# Altium project BMS Bottom Cell & Controller.PrjPcb
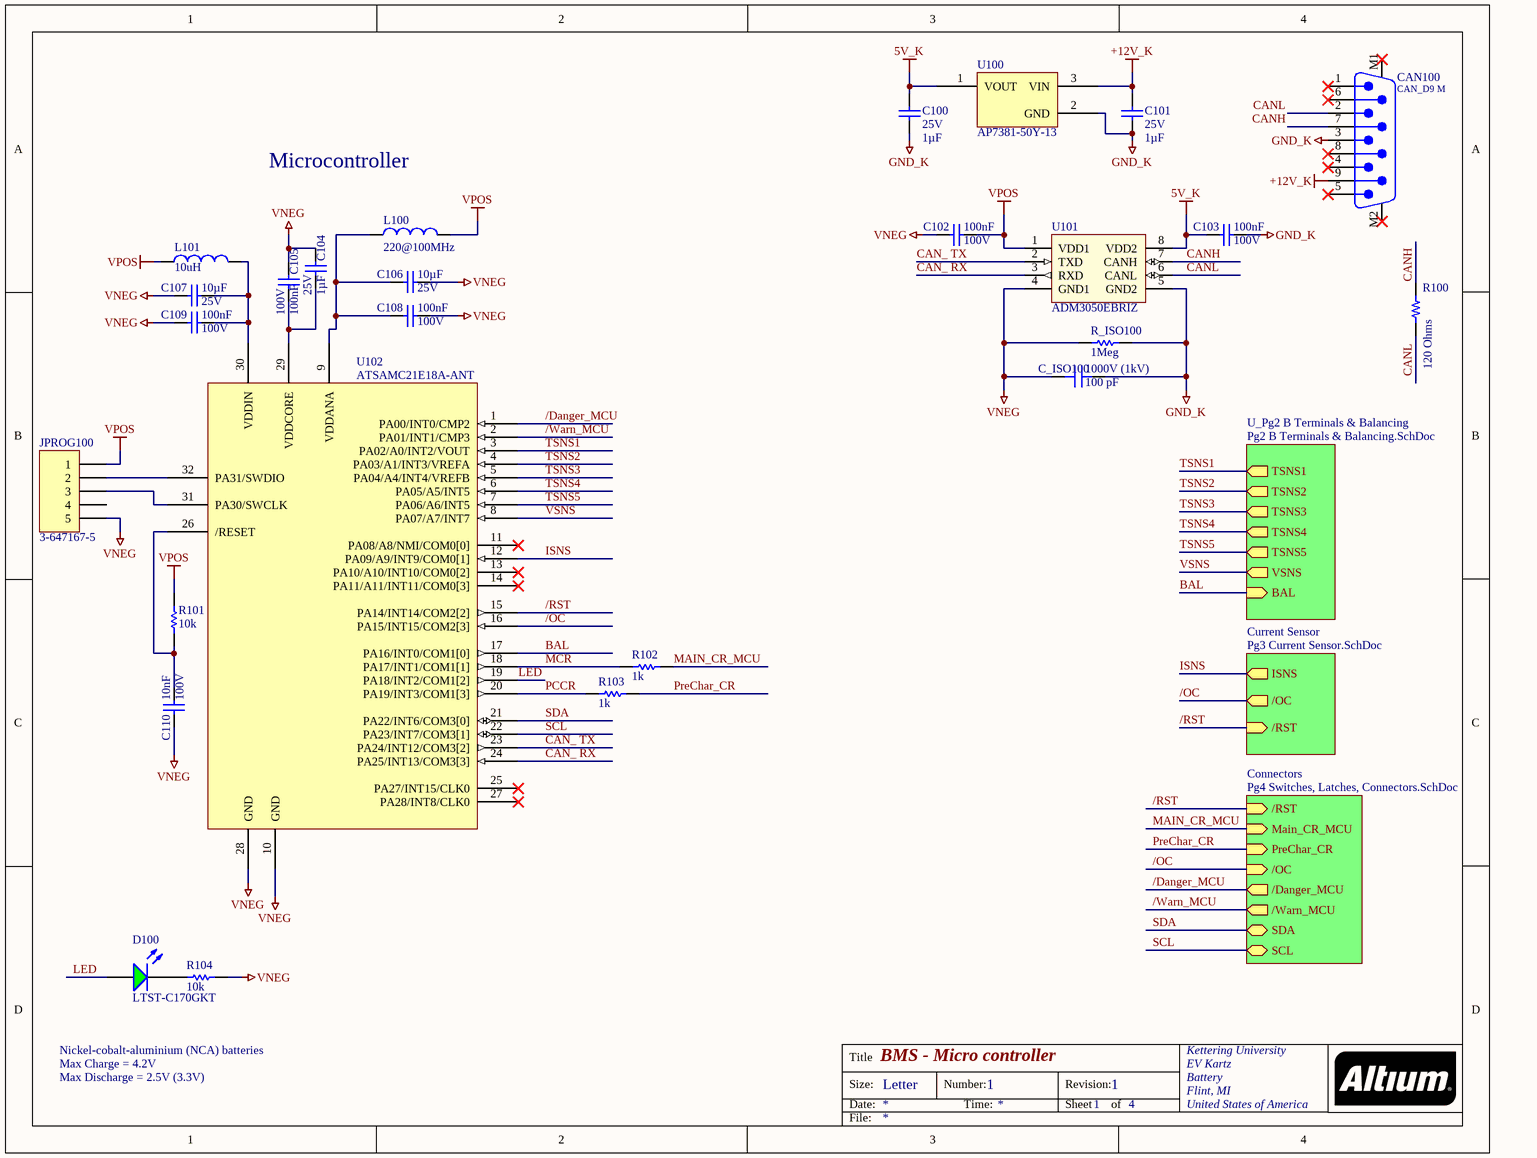
[diagram p0: Pg1 Top Sheet and Micro.SchDoc]
4 sheets, 164 parts. Net scope: hierarchical (ports join the sheet entries above them; power ports are global).
Board file: Bottom_Cell.PcbDoc
Sheets:
  Pg1 Top Sheet and Micro.SchDoc
    Current Sensor = Pg3 Current Sensor.SchDoc
    Connectors = Pg4 Switches, Latches, Connectors.SchDoc
    U_Pg2 B Terminals & Balancing = Pg2 B Terminals & Balancing.SchDoc

## Sheet Pg1 Top Sheet and Micro.SchDoc: BMS - Micro controller
size Letter; Organization: Kettering University; Address1: EV Kartz; Address2: Battery; Address3: Flint, MI; Address4: United States of America; DocumentNumber: 1; Revision: 1; SheetNumber: 1; SheetTotal: 4

### Parts
C100  value 1µF  Rated: 25V  [CAPC2012N]  (hidden comment: C0805C105K3RAC7210)
C101  value 1µF  Rated: 25V  [CAPC2012N]  (hidden comment: C0805C105K3RAC7210)
C102  value 100nF  Rated: 100V  [CAPC2012N]  (hidden comment: C0805C104K1RACAUTO)
C103  value 100nF  Rated: 100V  [CAPC2012N]  (hidden comment: C0805C104K1RACAUTO)
C104  value 1µF  Rated: 25V  [CAPC2012N]  (hidden comment: C0805C105K3RAC7210)
C105  value 100nF  Rated: 100V  [CAPC2012N]  (hidden comment: C0805C104K1RACAUTO)
C106  value 10µF  Rated: 25V  [CAPC3225N]  (hidden comment: C1210C106K3RACAUTO)
C107  value 10µF  Rated: 25V  [CAPC3225N]  (hidden comment: C1210C106K3RACAUTO)
C108  value 100nF  Rated: 100V  [CAPC2012N]  (hidden comment: C0805C104K1RACAUTO)
C109  value 100nF  Rated: 100V  [CAPC2012N]  (hidden comment: C0805C104K1RACAUTO)
C110  value 10nF  Rated: 100V  [CAPC2012N]  (hidden comment: C0805C103K1RAC7025)
C_ISO100  Voltage - Rated: 1000V (1kV)  [CAP 1206_3216 - 0.8MM]  (hidden comment: 100 pF)
CAN100  CAN_D9 M  [618009211721]
D100  LTST-C170GKT  [DIO2012N-G]
JPROG100  3-647167-5  [HDR1X5 SMT]
L100  value 220@100MHz  [INDC2012N]  (hidden comment: 742792022)
L101  value 10uH  [INDC3225N]  (hidden comment: BRL3225T100K)
R100  120 Ohms  [RES 0805_2012]
R101  value 10k  [RESC2012N]  (hidden comment: ERJ-6ENF1002V)
R102  value 1k  [RESC2012N]  (hidden comment: ERJ-6ENF1001V)
R103  value 1k  [RESC2012N]  (hidden comment: ERJ-6ENF1001V)
R104  value 10k  [RESC2012N]  (hidden comment: ERJ-6ENF1002V)
R_ISO100  value 1Meg  [RESC2012N]  (hidden comment: ERJ-6ENF1004V)
U100  AP7381-50Y-13  [DIODES INC SOT-89]
U101  ADM3050EBRIZ  [SOIC-8-300]
U102  ATSAMC21E18A-ANT  [SAMC21]

### Sub-sheets
Connectors = Pg4 Switches, Latches, Connectors.SchDoc: /RST (in), Main_CR_MCU (in), PreChar_CR (in), /Warn_MCU (out), /Danger_MCU (out), /OC (in), SDA (bidir), SCL (bidir)
Current Sensor = Pg3 Current Sensor.SchDoc: ISNS (out), /RST (in), /OC (out)
U_Pg2 B Terminals & Balancing = Pg2 B Terminals & Balancing.SchDoc: VSNS (out), TSNS1 (out), TSNS2 (out), TSNS3 (out), TSNS4 (out), TSNS5 (out), BAL (in)

### Nets
5V_K: C100.1 C103.1 U100.1(VOUT) U101.8(VDD2)
+12V_K: C101.1 CAN100.9 U100.3(VIN)
GND_K: C100.2 C101.2 C103.2 C_ISO100.2 CAN100.3 R_ISO100.2 U100.2(GND) U101.5(GND2)
VNEG: C102.1 C104.1 C105.1 C106.2 C107.1 C108.2 C109.1 C110.2 C_ISO100.1 JPROG100.5 R104.1 R_ISO100.1 U101.4(GND1) U102.10(GND) U102.28(GND)
VPOS: C102.2 JPROG100.1 L100.2 L101.1 R101.1 U101.1(VDD1)
/Danger_MCU: U102.1(PA00/INT0/CMP2) ; sheet Connectors//Danger_MCU
/OC: U102.16(PA15/INT15/COM2[3]) ; sheet Current Sensor//OC, sheet Connectors//OC
/RST: U102.15(PA14/INT14/COM2[2]) ; sheet Current Sensor//RST, sheet Connectors//RST
/Warn_MCU: U102.2(PA01/INT1/CMP3) ; sheet Connectors//Warn_MCU
BAL: U102.17(PA16/INT0/COM1[0]) ; sheet U_Pg2 B Terminals & Balancing/BAL
CAN_ RX: U101.3(RXD) U102.24(PA25/INT13/COM3[3])
CAN_ TX: U101.2(TXD) U102.23(PA24/INT12/COM3[2])
CANH: CAN100.7 R100.2 U101.7(CANH)
CANL: CAN100.2 R100.1 U101.6(CANL)
ISNS: U102.12(PA09/A9/INT9/COM0[1]) ; sheet Current Sensor/ISNS
LED: D100.1(A) U102.19(PA18/INT2/COM1[2])
MAIN_CR_MCU: R102.2 ; sheet Connectors/Main_CR_MCU
MCR: R102.1 U102.18(PA17/INT1/COM1[1])
PCCR: R103.1 U102.20(PA19/INT3/COM1[3])
PreChar_CR: R103.2 ; sheet Connectors/PreChar_CR
SCL: U102.22(PA23/INT7/COM3[1]) ; sheet Connectors/SCL
SDA: U102.21(PA22/INT6/COM3[0]) ; sheet Connectors/SDA
TSNS1: U102.3(PA02/A0/INT2/VOUT) ; sheet U_Pg2 B Terminals & Balancing/TSNS1
TSNS2: U102.4(PA03/A1/INT3/VREFA) ; sheet U_Pg2 B Terminals & Balancing/TSNS2
TSNS3: U102.5(PA04/A4/INT4/VREFB) ; sheet U_Pg2 B Terminals & Balancing/TSNS3
TSNS4: U102.6(PA05/A5/INT5) ; sheet U_Pg2 B Terminals & Balancing/TSNS4
TSNS5: U102.7(PA06/A6/INT5) ; sheet U_Pg2 B Terminals & Balancing/TSNS5
VSNS: U102.8(PA07/A7/INT7) ; sheet U_Pg2 B Terminals & Balancing/VSNS
NetC104_2: C104.2 C105.2 U102.29(VDDCORE)
NetC106_1: C106.1 C108.1 L100.1 U102.9(VDDANA)
NetC107_2: C107.2 C109.2 L101.2 U102.30(VDDIN)
NetC110_1: C110.1 R101.2 U102.26(/RESET)
NetD100_2: D100.2(K) R104.2
NetJPROG100_2: JPROG100.2 U102.32(PA31/SWDIO)
NetJPROG100_3: JPROG100.3 U102.31(PA30/SWCLK)

Not connected (* = marked no-connect by the designer): CAN100 1* 4* 5* 6* 8* M1* M2*; JPROG100 4; U102 11(PA08/A8/NMI/COM0[0])* 13(PA10/A10/INT10/COM0[2])* 14(PA11/A11/INT11/COM0[3])* 25(PA27/INT15/CLK0)* 27(PA28/INT8/CLK0)*

### Notes on the sheet
- Microcontroller
- Nickel-cobalt-aluminium (NCA) batteries
- Max Charge = 4.2V
- Max Discharge = 2.5V (3.3V)
- Title
- Size:
- Date:
- Letter
- Number:
- Time:
- Revision:
- Sheet
- of
- File:

### Library data of the parts
C100 C101 C104 = C0805C105K3RAC7210: Capacitor, Ceramic, 1µF, 25V, 0805, 10%, 125C; Supplier 1: Digi-Key; Supplier Part Number 1: 399-C0805C105K3RAC7210CT-ND; Category: C; Tol: 10%; Temp: 125C
C102 C103 C105 C108 C109 = C0805C104K1RACAUTO: Capacitor, Ceramic, 100nF, 100V, 0805, 10%, 125C; Supplier 1: Digi-Key; Supplier Part Number 1: 399-6926-1-ND; Category: C; Tol: 10%; Temp: 125C
C106 C107 = C1210C106K3RACAUTO: Capacitor, Ceramic, 10µF, 25V, 0805, 10%, 125C; Supplier 1: Digi-Key; Supplier Part Number 1: 399-7046-1-ND; Category: C; Tol: 10%; Temp: 125C
C110 = C0805C103K1RAC7025: Capacitor, Ceramic, 10nF, 100V, 0805, 10%, 125C; Supplier 1: Digi-Key; Supplier Part Number 1: 399-C0805C103K1RAC7025CT-ND; Category: C; Tol: 10%; Temp: 125C
C_ISO100 = CL31C101JIFNFNE: CAP CER 100PF 1KV C0G/NP0 1206; manufacturer: Samsung Electro-Mechanics; Temperature Coefficient: C0G, NP0; Tolerance: ±5%; Part Number: CL31C101JIFNFNE; Value: 100 pF; Applications: General Purpose; Capacitance: 100 pF; componentlink1description: Datasheet; componentlink1url: http://www.samsungsem.com/kr/support/product-search/mlcc/CL31C101JIFNFNE.jsp; componentlink2description: DigiKey Link; componentlink2url: https://www.digikey.com/en/products/detail/samsung-electro-mechanics/CL31C101JIFNFNE/3888857; Device Package: 1206 (3216 Metric); lastupdated: 2/4/2023 8:13:04 PM; Lifecycle Status: Active; Minimum Order: 1; Mounting Type: Surface Mount, MLCC; Operating Temperature: -55°C ~ 125°C; Package / Case: 1206 (3216 Metric); packaging: TapeAndReel; partid: 22341; Part Status: Active; price: 0.05; series: CL; Size / Dimension: 0.126" L x 0.063" W (3.20mm x 1.60mm); Supplier 1: DigiKey; Supplier Part Number 1: 1276-3199-1-ND; Thickness (Max): 0.055" (1.40mm)
CAN100 = CMP-1502-00292-1: Male PCB Connector without Hex Screw WR-DSUB, 8.08 mm, Angled, 9 pins; Manufacturer: Wurth Elektronik; Rated Current: 3A; Working Voltage: 125VAC; Pin Number: 9; Contact Resistance: 30mOhm; Publisher: WurthElektronik; Operating Temperature: -40to85degC; Part Number: 618009211721; Package Reference: 618009211721; Manufacturer URL: http://www.we-online.de; Mounting Technology: THT; Datasheet URL: https://katalog.we-online.de/em/datasheet/6180xx211721.pdf; Gender: Male; Packaging: Tray; Orientation: Angled
D100 = LTST-C170GKT: LED, SMT 0805, Green, 2.1V, 10mA; Rated: 2.1V, 10mA, 6mcd; Value: GRN; Supplier 1: Digi-Key; Supplier Part Number 1: 160-1179-1-ND; Category: D
JPROG100 = Hdr 3-647167-5: Header, 1x5-Pin, SMT, 100mil Pitch; Category: J; Supplier 1: Digi-Key; Supplier Part Number 1: A144616-ND
L100 = 742792022: Inductor, 220 Ohms @ 100MHz, 2A, 50 mOhm, Ferrite Bead; Category: L; Supplier 1: Digi-Key; Supplier Part Number 1: 732-1614-1-ND; Rated: 2A
L101 = BRL3225T100K: Inductor, 10uH, 700mA, 420mOhm, Ferrite Bead; Rated: 700mA, 0.42 Ohm; Category: L; Supplier 1: Digi-Key; Supplier Part Number 1: 587-2167-1-ND
R100 = RC0805FR-07120RL: RES 120 OHM 1% 1/8W 0805; Manufacturer: Yageo; Power (Watts): 0.125W, 1/8W; Temperature Coefficient: ±100ppm/°C; Part Number: RC0805FR-07120RL; Value: 120 Ohms; ComponentLink1Description: Datasheet; ComponentLink1URL: https://www.yageo.com/upload/media/product/productsearch/datasheet/rchip/PYu-RC_Group_51_RoHS_L_10.pdf; ComponentLink2Description: DigiKey Link; ComponentLink2URL: https://www.digikey.com/en/products/detail/yageo/RC0805FR-07120RL/727575; Composition: Thick Film; Device Package: 0805 (2012 Metric); Features: Moisture Resistant; Height - Seated (Max): 0.024" (0.60mm); LastUpdated: 2/3/2023 8:42:17 PM; Lifecycle Status: Active; Minimum Order: 1; Number of Terminations: 2; Operating Temperature: -55°C ~ 155°C; Package / Case: 0805 (2012 Metric); Packaging: CutTape; PartId: 39440; Part Status: Active; Price: 0.01; Resistance: 120 Ohms; Series: RC_L; Size / Dimension: 0.079" L x 0.049" W (2.00mm x 1.25mm); Supplier 1: DigiKey; Supplier Part Number 1: 311-120CRCT-ND; Supplier Device Package: 0805; Tolerance: ±1%
R101 R104 = ERJ-6ENF1002V: Resistor, Fixed, 10 kOhm, 0805, 1%, 1/8W; Supplier 1: Digi-Key; Supplier Part Number 1: P10.0KCCT-ND; Rated: 1/8W; Tol: 1%; Category: R
R102 R103 = ERJ-6ENF1001V: Resistor, Fixed, 1 kOhm, 0805, 1%, 1/8W; Supplier 1: Digi-Key; Supplier Part Number 1: P1.00KCCT-ND; Rated: 1/8W; Tol: 1%; Category: R
R_ISO100 = ERJ-6ENF1004V: Resistor, Fixed, 1 MOhm, 0805, 1%, 1/8W; Supplier 1: Digi-Key; Supplier Part Number 1: P1.00MCCT-ND; Rated: 1/8W; Tol: 1%; Category: R
U100 = AP7381-50Y-13: IC REG LINEAR 5V 150MA SOT89; Manufacturer: Diodes Incorporated; Current - Quiescent (Iq): 2.5 µA; Current - Supply (Max): 25 µA; Number of Regulators: 1; Output Configuration: Positive; Output Type: Fixed; Protection Features: Current Limit, Thermal Shutdown; Voltage Dropout (Max): 1V @ 100mA; Voltage - Input (Max): 40V; Part Number: AP7381-50Y-13; ComponentLink1Description: Datasheet; ComponentLink1URL: https://www.diodes.com/assets/Datasheets/AP7381.pdf; ComponentLink2Description: DigiKey Link; ComponentLink2URL: https://www.digikey.com/en/products/detail/diodes-incorporated/AP7381-50Y-13/7914855; Current - Output: 150mA; LastUpdated: 2/3/2023 9:04:39 PM; Lifecycle Status: Active; Minimum Order: 1; Mounting Type: Surface Mount; Operating Temperature: -40°C ~ 125°C (TJ); Package / Case: TO-243AA; Packaging: TapeAndReel; Part Status: Active; Price: 0.09; Series: -; Supplier 1: DigiKey; Supplier Part Number 1: AP7381-50Y-13DICT-ND; Supplier Device Package: SOT-89-3; Voltage - Output (Min/Fixed): 5V
U101 = ADM3050EBRIZ: IC, Transceiver, CAN FD, 0.5-6V, ISOLATED; Category: U; Supplier 1: Digi-Key; Supplier Part Number 1: 505-ADM3050EBRIZ-ND
U102 = ATSAMC21E: ARM Microcontrollers - MCU 32TQFP,105C TEMP, GREEN, 5V, 48MHZ; Supplier 1: Mouser; Supplier Part Number 1: 556-ATSAMC21E18A-ANT

## Sheet Pg3 Current Sensor.SchDoc: LEM Current Sensor Integration
size Letter; Engineer: Jon Larr; Organization: EV Kartz; Address1: Kettering University; Address2: 1700 University Ave; Address3: Flint, MI; Address4: United States of America; SheetNumber: 2; SheetTotal: 4
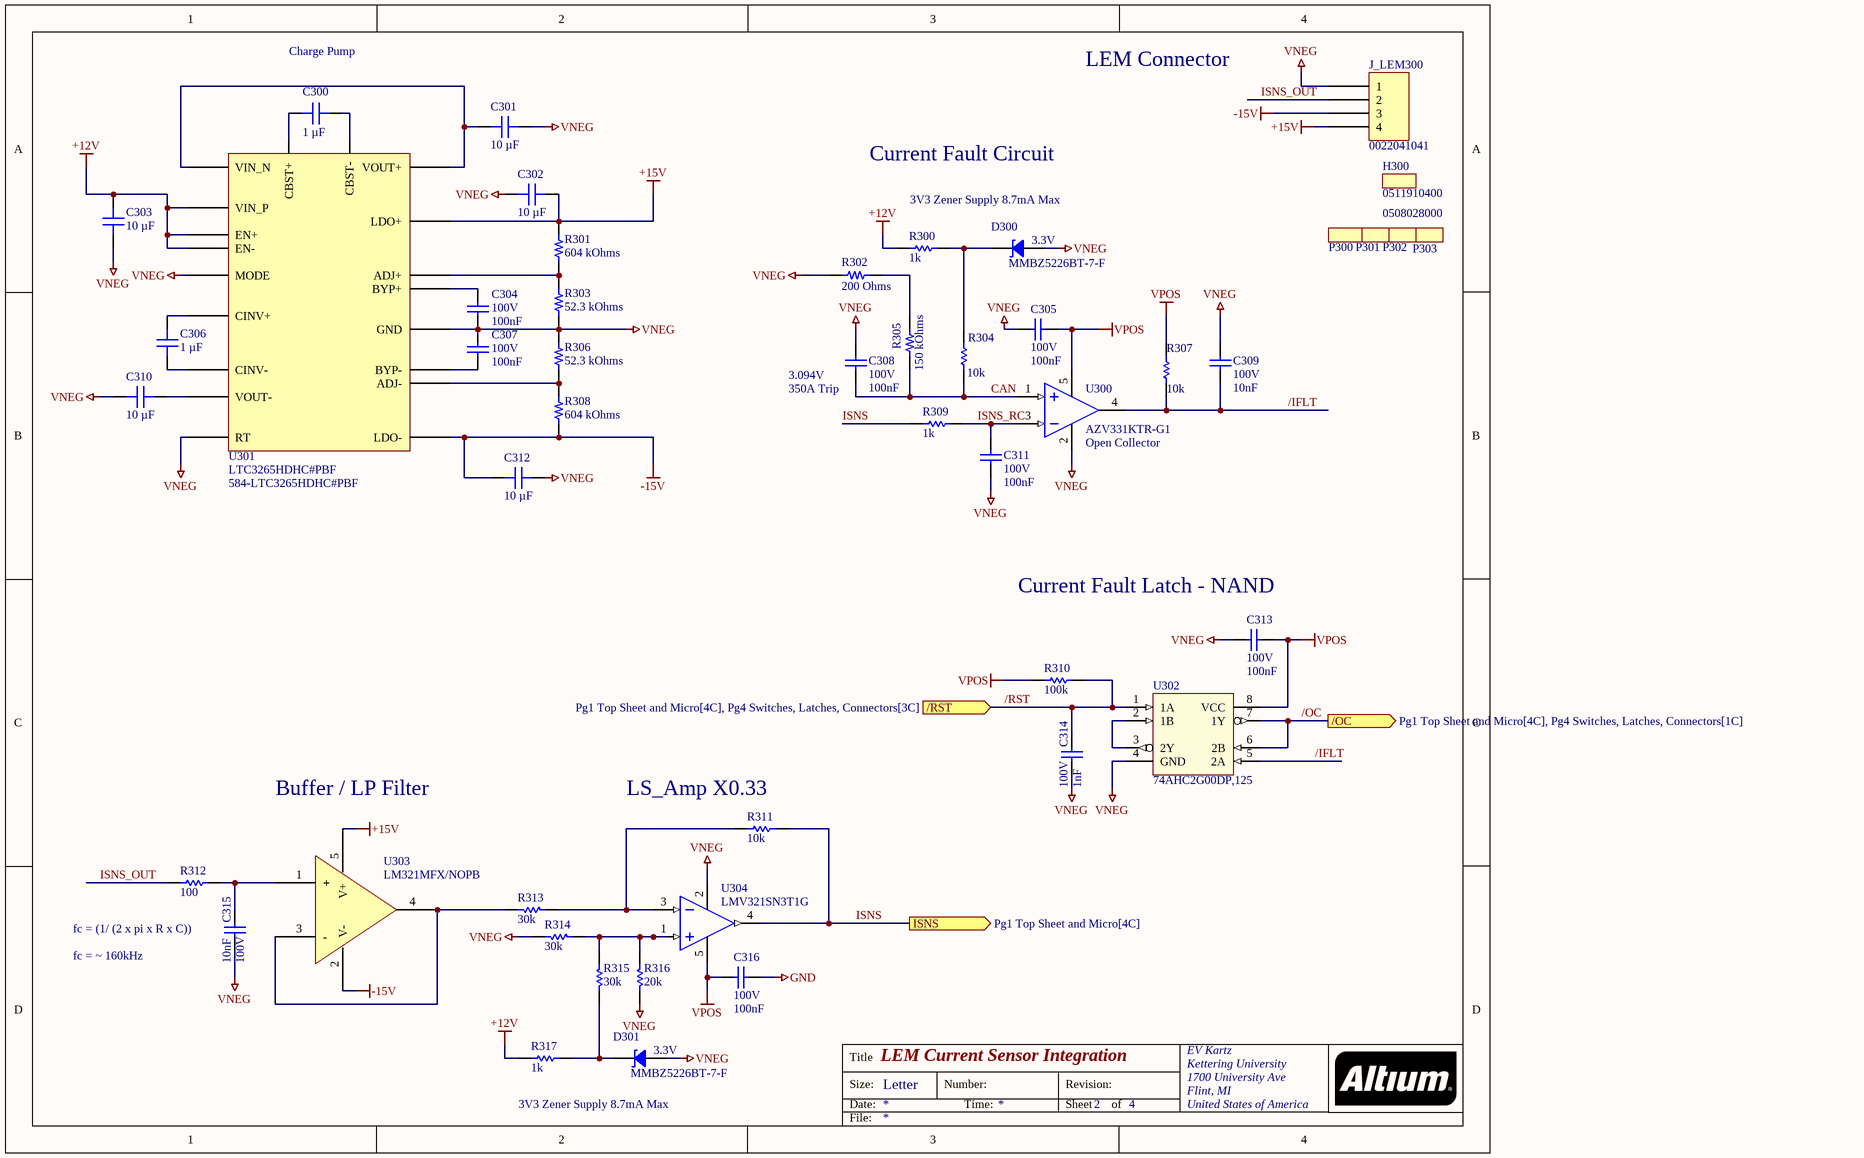
[diagram p1: Pg3 Current Sensor.SchDoc]

### Parts
C300  1 µF  [CAP 0805_2012]
C301  10 µF  [CAP 1206_3216 - 0.8MM]
C302  10 µF  [CAP 1206_3216 - 0.8MM]
C303  10 µF  [CAP 1206_3216 - 0.8MM]
C304  value 100nF  Rated: 100V  [CAPC2012N]  (hidden comment: C0805C104K1RACAUTO)
C305  value 100nF  Rated: 100V  [CAPC2012N]  (hidden comment: CL21B104KACNNNC)
C306  1 µF  [CAP 0805_2012]
C307  value 100nF  Rated: 100V  [CAPC2012N]  (hidden comment: C0805C104K1RACAUTO)
C308  value 100nF  Rated: 100V  [CAPC2012N]  (hidden comment: CL21B104KACNNNC)
C309  value 10nF  Rated: 100V  [CAPC2012N]  (hidden comment: C0805C103K1RAC7025)
C310  10 µF  [CAP 1206_3216 - 0.8MM]
C311  value 100nF  Rated: 100V  [CAPC2012N]  (hidden comment: CL21B104KACNNNC)
C312  10 µF  [CAP 1206_3216 - 0.8MM]
C313  value 100nF  Rated: 100V  [CAPC2012N]  (hidden comment: CL21B104KACNNNC)
C314  value 1nF  Rated: 100V  [CAPC2012N]  (hidden comment: C0805C102K1RACAUTO)
C315  value 10nF  Rated: 100V  [CAPC2012N]  (hidden comment: C0805C103K1RAC7025)
C316  value 100nF  Rated: 100V  [CAPC2012N]  (hidden comment: C0805C104K1RACAUTO)
D300  MMBZ5226BT-7-F  [DIODES SOT-523]
D301  MMBZ5226BT-7-F  [DIODES SOT-523]
H300  0511910400  (mechanical)
J_LEM300  0022041041  [0022041041]
P300  0508028000  (value not drawn)  (mechanical)
P301  0508028000  (value not drawn)  (mechanical)
P302  0508028000  (value not drawn)  (mechanical)
P303  0508028000  (mechanical)
R300  value 1k  [RESC2012N]  (hidden comment: ERJ-6ENF1001V)
R301  604 kOhms  [RES 0805_2012]
R302  200 Ohms  [RES 0805_2012]
R303  52.3 kOhms  [RES 0805_2012]
R304  value 10k  [RESC2012N]  (hidden comment: ERJ-6ENF1002V)
R305  150 kOhms  [RES 0805_2012]
R306  52.3 kOhms  [RES 0805_2012]
R307  value 10k  [RESC2012N]  (hidden comment: ERJ-6ENF1002V)
R308  604 kOhms  [RES 0805_2012]
R309  value 1k  [RESC2012N]  (hidden comment: ERJ-6ENF1001V)
R310  value 100k  [RESC2012N]  (hidden comment: ERJ-6ENF1003V)
R311  value 10k  [RESC2012N]  (hidden comment: ERJ-6ENF1002V)
R312  value 100  [RESC2012N]  (hidden comment: ERJ-6ENF1000V)
R313  value 30k  [RESC2012N]  (hidden comment: ERJ-6ENF3002V)
R314  value 30k  [RESC2012N]  (hidden comment: ERJ-6ENF3002V)
R315  value 30k  [RESC2012N]  (hidden comment: ERJ-6ENF3002V)
R316  value 20k  [RESC2012N]  (hidden comment: ERJ-6ENF2002V)
R317  value 1k  [RESC2012N]  (hidden comment: ERJ-6ENF1001V)
U300  AZV331KTR-G1  [SOT23-5N]
U301  LTC3265HDHC#PBF  Supplier Part Number 1: 584-LTC3265HDHC#PBF  [DHC]
U302  74AHC2G00DP,125  [TSSOP-8]
U303  LM321MFX/NOPB  [TI SOT-23-5 DBV]
U304  LMV321SN3T1G  [SOT23-5N]

### Ports
/OC (out, see Pg1 Top Sheet and Micro[4C], Pg4 Switches, Latches, Connectors[1C]), /RST (in, see Pg1 Top Sheet and Micro[4C], Pg4 Switches, Latches, Connectors[3C]), ISNS (out, see Pg1 Top Sheet and Micro[4C])

### Nets
+12V: C303.1 R300.1 R317.1 U301.3(VIN_P) U301.4(EN-) U301.13(EN+)
+15V: C302.2 J_LEM300.4 R301.2 U301.17(LDO+) U303.5(V+)
-15V: C312.2 J_LEM300.3 R308.1 U301.7(LDO-) U303.2(V-)
GND: C316.2
VNEG: C301.2 C302.1 C303.2 C304.2 C305.2 C307.1 C308.1 C309.1 C310.2 C311.2 C312.1 C313.2 C314.2 C315.2 D300.1 D301.1 J_LEM300.1 R302.1 R303.1 R306.2 R314.2 R316.1 U300.2(VEE) U301.12(RT) U301.14(MODE) U301.19(GND) U302.4(GND) U304.2(V-)
VPOS: C305.1 C313.1 C316.1 R307.1 R310.2 U300.5(VCC) U302.8(VCC) U304.5(V+)
/IFLT: C309.2 R307.2 U300.4(OUT) U302.5(2A)
/OC: U302.6(2B) U302.7(1Y) ; port /OC
/RST: C314.1 R310.1 U302.1(1A) ; port /RST
CAN: C308.2 R304.2 R305.1 U300.1(IN+)
ISNS: R309.1 R311.1 U304.4(OUT) ; port ISNS
ISNS_OUT: J_LEM300.2 R312.1
ISNS_RC: C311.1 R309.2 U300.3(IN-)
NetC300_1: C300.1 U301.2(CBST+)
NetC300_2: C300.2 U301.1(CBST-)
NetC301_1: C301.1 U301.11(VIN_N) U301.18(VOUT+)
NetC304_1: C304.1 U301.15(BYP+)
NetC306_1: C306.1 U301.9(CINV-)
NetC306_2: C306.2 U301.10(CINV+)
NetC307_2: C307.2 U301.5(BYP-)
NetC310_1: C310.1 U301.8(VOUT-)
NetC315_1: C315.1 R312.2 U303.1(+)
NetD300_2: D300.2 R300.2 R304.1
NetD301_2: D301.2 R315.1 R317.2
NetR301_1: R301.1 R303.2 U301.16(ADJ+)
NetR302_2: R302.2 R305.2
NetR306_1: R306.1 R308.2 U301.6(ADJ-)
NetR311_2: R311.2 R313.1 U304.3(IN-)
NetR313_2: R313.2 U303.3(-) U303.4(OUT)
NetR314_1: R314.1 R315.2 R316.2 U304.1(IN+)
NetU302_2: U302.2(1B) U302.3(2Y)

### Notes on the sheet
- Charge Pump
- LEM Connector
- Current Fault Circuit
- 3V3 Zener Supply 8.7mA Max
- (near D300) 3.3V
- (near C308) 3.094V
- (near C308) 350A Trip
- (near U300) Open Collector
- (near C313) Current Fault Latch - NAND
- Buffer / LP Filter
- (near R311) LS_Amp X0.33
- (near C315) fc = (1/ (2 x pi x R x C))
- fc = ~ 160kHz
- (near D301) 3.3V
- Title
- Size:
- Date:
- Letter
- Number:
- Time:
- Revision:
- Sheet
- of
- File:

### Library data of the parts
C300 C306 = GRM21BC72A105KE01L: CAP CER 1UF 100V X7S 0805; manufacturer: Murata Electronics; Tolerance: ±10%; Part Number: GRM21BC72A105KE01L; Value: 1 µF; Applications: General Purpose; Capacitance: 1 µF; componentlink1description: Datasheet; componentlink1url: https://search.murata.co.jp/Ceramy/image/img/A01X/G101/ENG/GRM21BC72A105KE01-01.pdf; componentlink2description: DigiKey Link; componentlink2url: https://www.digikey.com/en/products/detail/murata-electronics/GRM21BC72A105KE01L/6606093; Device Package: 0805 (2012 Metric); lastupdated: 1/31/2023 8:11:09 PM; Lifecycle Status: Active; Minimum Order: 1; Mounting Type: Surface Mount, MLCC; Operating Temperature: -55°C ~ 125°C; Package / Case: 0805 (2012 Metric); packaging: TapeAndReel; partid: 8550; Part Status: Active; price: 0.07; series: GRM; Size / Dimension: 0.079" L x 0.049" W (2.00mm x 1.25mm); Supplier 1: DigiKey; Supplier Part Number 1: 490-14464-1-ND; Temperature Coefficient: X7S; Thickness (Max): 0.057" (1.45mm); Voltage - Rated: 100V
C301-C303 C310 C312 = 1206X106K250CT: CAP CER 10UF 25V X5R 1206; manufacturer: Walsin Technology Corporation; Tolerance: ±10%; Part Number: 1206X106K250CT; Value: 10 µF; Applications: General Purpose; Capacitance: 10 µF; componentlink1description: Datasheet; componentlink1url: https://www.passivecomponent.com/wp-content/uploads/datasheet/WTC_MLCC_General_Purpose.pdf; componentlink2description: DigiKey Link; componentlink2url: https://www.digikey.com/en/products/detail/walsin-technology-corporation/1206X106K250CT/14836856; Device Package: 1206 (3216 Metric); lastupdated: 1/31/2023 8:12:49 PM; Lifecycle Status: Active; Minimum Order: 1; Mounting Type: Surface Mount, MLCC; Operating Temperature: -55°C ~ 85°C; Package / Case: 1206 (3216 Metric); packaging: TapeAndReel; partid: 45632; Part Status: Active; price: 0.10; series: -; Size / Dimension: 0.126" L x 0.063" W (3.20mm x 1.60mm); Supplier 1: DigiKey; Supplier Part Number 1: 1292-1206X106K250CT-ND; Temperature Coefficient: X5R; Thickness (Max): 0.075" (1.90mm); Voltage - Rated: 25V
C304 C307 C316 = C0805C104K1RACAUTO: as C102 on sheet Pg1 Top Sheet and Micro; Supplier 1: Digi-Key; Supplier Part Number 1: 399-6926-1-ND; Category: C; Tol: 10%; Temp: 125C
C305 C308 C311 C313 = C0805C104K1RACAUTO: Capacitor, Ceramic, 100nF, 25V, 0805, 10%, 125C; Category: C; Tol: 10%; Temp: 125C; Supplier 1: Digi-Key; Supplier Part Number 1: 1276-1099-1-ND
C309 C315 = C0805C103K1RAC7025: as C110 on sheet Pg1 Top Sheet and Micro; Supplier 1: Digi-Key; Supplier Part Number 1: 399-C0805C103K1RAC7025CT-ND; Category: C; Tol: 10%; Temp: 125C
C314 = C0805C102K1RACAUTO: Capacitor, Ceramic, 1nF, 100V, 0805, 10%, 125C; Supplier 1: Digi-Key; Supplier Part Number 1: 399-6919-1-ND; Category: C; Tol: 10%; Temp: 125C
D300 D301 = MMBZ5226BT-7-F: DIODE ZENER 3.3V 150MW SOT523; Manufacturer: Diodes Incorporated; Current - Reverse Leakage @ Vr: 25 µA @ 1 V; Impedance (Max) (Zzt): 28 Ohms; Tolerance: ±5%; Voltage - Forward (Vf) (Max) @ If: 900 mV @ 10 mA; Part Number: MMBZ5226BT-7-F; ComponentLink1Description: Datasheet; ComponentLink1URL: https://www.diodes.com/assets/Datasheets/ds30267.pdf; ComponentLink2Description: DigiKey Link; ComponentLink2URL: https://www.digikey.com/en/products/detail/diodes-incorporated/MMBZ5226BT-7-F/2095654; LastUpdated: 1/31/2023 8:49:11 PM; Lifecycle Status: Active; Minimum Order: 1; Mounting Type: Surface Mount; Operating Temperature: -65°C ~ 150°C; Package / Case: SOT-523; Packaging: TapeAndReel; PartId: 790; Part Status: Active; Power - Max: 150 mW; Price: 0.05; Series: -; Supplier 1: DigiKey; Supplier Part Number 1: MMBZ5226BTDICT-ND; Supplier Device Package: SOT-523; Voltage - Zener (Nom) (Vz): 3.3 V
H300 = 0022041041(Housing): Housing, Molex, Maiting Part 0511910400; Value: 4 Pos; Category: J; Supplier 1: Digi-Key; Supplier Part Number 1: WM3350-ND
J_LEM300 = 0022041041: Header, 4 pos, 2.5mm pitch, Molex / Kit Parts / Housing: 0511910400 / Terminals: 0508028000; Value: 4 Pos; Temp: 80C; Rated: N/A; Category: J; Tol: N/A; Supplier 1: Digi-Key; Supplier Part Number 1: WM18787-ND
P300-P303 = 0022041041(Terminal): Terminal, Molex, Maiting Part 0511910400; Value: 4 Pos; Category: J; Supplier 1: Digi-Key; Supplier Part Number 1: WM3328CT-ND
R300 R309 R317 = ERJ-6ENF1001V: Resistor, Fixed, 1 kOhm, 0805, 1%, 1/8W; Supplier 1: Digi-Key; Supplier Part Number 1: P1.00KCCT-ND; Rated: 1/8W; Tol: 1%; Category: R
R301 R308 = RMCF0805FT604K: RES 604K OHM 1% 1/8W 0805; Manufacturer: Stackpole Electronics Inc; Power (Watts): 0.125W, 1/8W; Temperature Coefficient: ±100ppm/°C; Part Number: RMCF0805FT604K; Value: 604 kOhms; ComponentLink1Description: Datasheet; ComponentLink1URL: https://www.seielect.com/catalog/sei-rmcf_rmcp.pdf; ComponentLink2Description: DigiKey Link; ComponentLink2URL: https://www.digikey.com/en/products/detail/stackpole-electronics-inc/RMCF0805FT604K/1760364; Composition: Thick Film; Device Package: 0805 (2012 Metric); Features: Automotive AEC-Q200; Height - Seated (Max): 0.026" (0.65mm); LastUpdated: 1/2/2023 8:44:07 PM; Lifecycle Status: Active; Minimum Order: 1; Number of Terminations: 2; Operating Temperature: -55°C ~ 155°C; Package / Case: 0805 (2012 Metric); Packaging: CutTape; PartId: 38394; Part Status: Active; Price: 0.01; Ratings: AEC-Q200; Resistance: 604 kOhms; Series: RMCF; Size / Dimension: 0.079" L x 0.049" W (2.00mm x 1.25mm); Supplier 1: DigiKey; Supplier Part Number 1: 738-RMCF0805FT604KCT-ND; Supplier Device Package: 0805; Tolerance: ±1%
R302 = ERA-6AED201V: RES 200 OHM 0.5% 1/8W 0805; Manufacturer: Panasonic Electronic Components; Power (Watts): 0.125W, 1/8W; Temperature Coefficient: ±25ppm/°C; Part Number: ERA-6AED201V; Value: 200 Ohms; ComponentLink1Description: Datasheet; ComponentLink1URL: https://industrial.panasonic.com/cdbs/www-data/pdf/RDM0000/AOA0000C307.pdf; ComponentLink2Description: DigiKey Link; ComponentLink2URL: https://www.digikey.com/en/products/detail/panasonic-electronic-components/ERA-6AED201V/9373598; Composition: Thin Film; Device Package: 0805 (2012 Metric); Features: Automotive AEC-Q200; Height - Seated (Max): 0.024" (0.60mm); LastUpdated: 1/2/2023 8:43:38 PM; Lifecycle Status: Active; Minimum Order: 1; Number of Terminations: 2; Operating Temperature: -55°C ~ 155°C; Package / Case: 0805 (2012 Metric); Packaging: TapeAndReel; PartId: 45624; Part Status: Active; Price: 0.05; Ratings: AEC-Q200; Resistance: 200 Ohms; Series: ERA-6A; Size / Dimension: 0.079" L x 0.049" W (2.00mm x 1.25mm); Supplier 1: DigiKey; Supplier Part Number 1: P123819CT-ND; Supplier Device Package: 0805; Tolerance: ±0.5%
R303 R306 = RMCF0805FT52K3: RES 52.3K OHM 1% 1/8W 0805; Manufacturer: Stackpole Electronics Inc; Power (Watts): 0.125W, 1/8W; Temperature Coefficient: ±100ppm/°C; Part Number: RMCF0805FT52K3; Value: 52.3 kOhms; ComponentLink1Description: Datasheet; ComponentLink1URL: https://www.seielect.com/catalog/sei-rmcf_rmcp.pdf; ComponentLink2Description: DigiKey Link; ComponentLink2URL: https://www.digikey.com/en/products/detail/stackpole-electronics-inc/RMCF0805FT52K3/1760139; Composition: Thick Film; Device Package: 0805 (2012 Metric); Features: Automotive AEC-Q200; Height - Seated (Max): 0.026" (0.65mm); LastUpdated: 1/2/2023 8:44:08 PM; Lifecycle Status: Active; Minimum Order: 1; Number of Terminations: 2; Operating Temperature: -55°C ~ 155°C; Package / Case: 0805 (2012 Metric); Packaging: CutTape; PartId: 38093; Part Status: Active; Price: 0.01; Ratings: AEC-Q200; Resistance: 52.3 kOhms; Series: RMCF; Size / Dimension: 0.079" L x 0.049" W (2.00mm x 1.25mm); Supplier 1: DigiKey; Supplier Part Number 1: RMCF0805FT52K3CT-ND; Supplier Device Package: 0805; Tolerance: ±1%
R304 R307 R311 = ERJ-6ENF1002V: Resistor, Fixed, 10 kOhm, 0805, 1%, 1/8W; Supplier 1: Digi-Key; Supplier Part Number 1: P10.0KCCT-ND; Rated: 1/8W; Tol: 1%; Category: R
R305 = ERA-6AEB154V: RES 150K OHM 0.1% 1/8W 0805; Manufacturer: Panasonic Electronic Components; Power (Watts): 0.125W, 1/8W; Temperature Coefficient: ±25ppm/°C; Part Number: ERA-6AEB154V; Value: 150 kOhms; ComponentLink1Description: Datasheet; ComponentLink1URL: https://industrial.panasonic.com/cdbs/www-data/pdf/RDM0000/AOA0000C307.pdf; ComponentLink2Description: DigiKey Link; ComponentLink2URL: https://www.digikey.com/en/products/detail/panasonic-electronic-components/ERA-6AEB154V/1465801; Composition: Thin Film; Device Package: 0805 (2012 Metric); Features: Automotive AEC-Q200; Height - Seated (Max): 0.024" (0.60mm); LastUpdated: 1/2/2023 8:43:14 PM; Lifecycle Status: Active; Minimum Order: 1; Number of Terminations: 2; Operating Temperature: -55°C ~ 155°C; Package / Case: 0805 (2012 Metric); Packaging: TapeAndReel; PartId: 48804; Part Status: Active; Price: 0.04; Ratings: AEC-Q200; Resistance: 150 kOhms; Series: ERA-6A; Size / Dimension: 0.079" L x 0.049" W (2.00mm x 1.25mm); Supplier 1: DigiKey; Supplier Part Number 1: P150KDACT-ND; Supplier Device Package: 0805; Tolerance: ±0.1%
R310 = ERJ-6ENF1003V: Resistor, Fixed, 100 kOhm, 0805, 1%, 1/8W; Supplier 1: Digi-Key; Supplier Part Number 1: P100KCCT-ND; Rated: 1/8W; Tol: 1%; Category: R
R312 = ERJ-6ENF1000V: Resistor, Fixed, 100 Ohm, 0805, 1%, 1/8W; Supplier 1: Digi-Key; Supplier Part Number 1: P100CCT-ND; Category: R; Rated: 1/8W; Tol: 1%
R313-R315 = ERJ-6ENF2002V: Resistor, Fixed, 30 kOhm, 0805, 1%, 1/8W; Rated: 1/8W; Tol: 1%; Category: R; Supplier 1: Digi-Key; Supplier Part Number 1: P30.0KCCT-ND
R316 = ERJ-6ENF2002V: Resistor, Fixed, 20 kOhm, 0805, 1%, 1/8W; Rated: 1/8W; Tol: 1%; Supplier 1: Digi-Key; Supplier Part Number 1: P20.0KCCT-ND; Category: R
U300 = AZV331: Comparator, Single, Open-Drain, 84mA, 2.2V~5.5V; Rated: 2.2V~5.5V; Supplier 1: Digi-Key; Supplier Part Number 1: AZV331KTR-G1DICT-ND; Category: U
U301 = LTC3265HDHC: Supply, Bipolar Charge Pump, +/-15V; Supplier 1: Mouser
U302 = 74AHC2G00: Logic, NAND, Dual, Schmitt Trigger, TSSOP-8; Rated: 5.5V, 24mA; Category: U; Supplier 1: Digi-Key; Supplier Part Number 1: 1727-6521-1-ND
U303 = LM321MFX/NOPB: IC OPAMP GP 1 CIRCUIT SOT23-5; Manufacturer: Texas Instruments; Amplifier Type: General Purpose; Current - Input Bias: 45nA; Current - Output / Channel: 40mA; Current - Supply: 660µA; Gain Bandwidth Product: 1MHz; Number of Circuits: 1; Slew Rate: 0.4V/µs; Voltage - Input Offset: 2mV; Voltage - Supply, Single/Dual (±): 3V ~ 30V, ±1.5V ~ 15V; Part Number: LM321MFX/NOPB; ComponentLink1Description: Datasheet; ComponentLink1URL: http://www.ti.com/general/docs/suppproductinfo.tsp?distId=10&gotoUrl=http%3A%2F%2Fwww.ti.com%2Flit%2Fgpn%2Flm321; ComponentLink2Description: DigiKey Link; ComponentLink2URL: http://digikey.com/product-detail/en/texas-instruments/LM321MFX-NOPB/LM321MFX-NOPBCT-ND/3440175; Device Package: SC-74A, SOT-753; LastUpdated: 3/30/2020 3:10:59 PM; Lifecycle Status: Active; Minimum Order: 1; Mounting Type: Surface Mount; Operating Temperature: -40°C ~ 85°C; Package / Case: SC-74A, SOT-753; Packaging: TapeAndReel; PartId: 11; Part Status: Active; Price: 0.23; Series: -; Supplier 1: DigiKey; Supplier Part Number 1: LM321MFX/NOPBCT-ND; Supplier Device Package: SOT-23-5
U304 = LMV321: Op-Amp, Single, 1MHz, 1V/us, R2R, 2.7V~5.5V, 160mA; Rated: 2.7V~5.5V, 160mA; Supplier 1: Digi-Key; Supplier Part Number 1: LMV321SN3T1GOSCT-ND; Category: U

## Sheet Pg4 Switches, Latches, Connectors.SchDoc: Switches and Safety Latches
size Letter; Organization: Altium Limited; Address1: L3, 12a Rodborough Rd; Address2: Frenchs Forest; Address3: NSW; Address4: Australia 2086; SheetNumber: 4; SheetTotal: 4
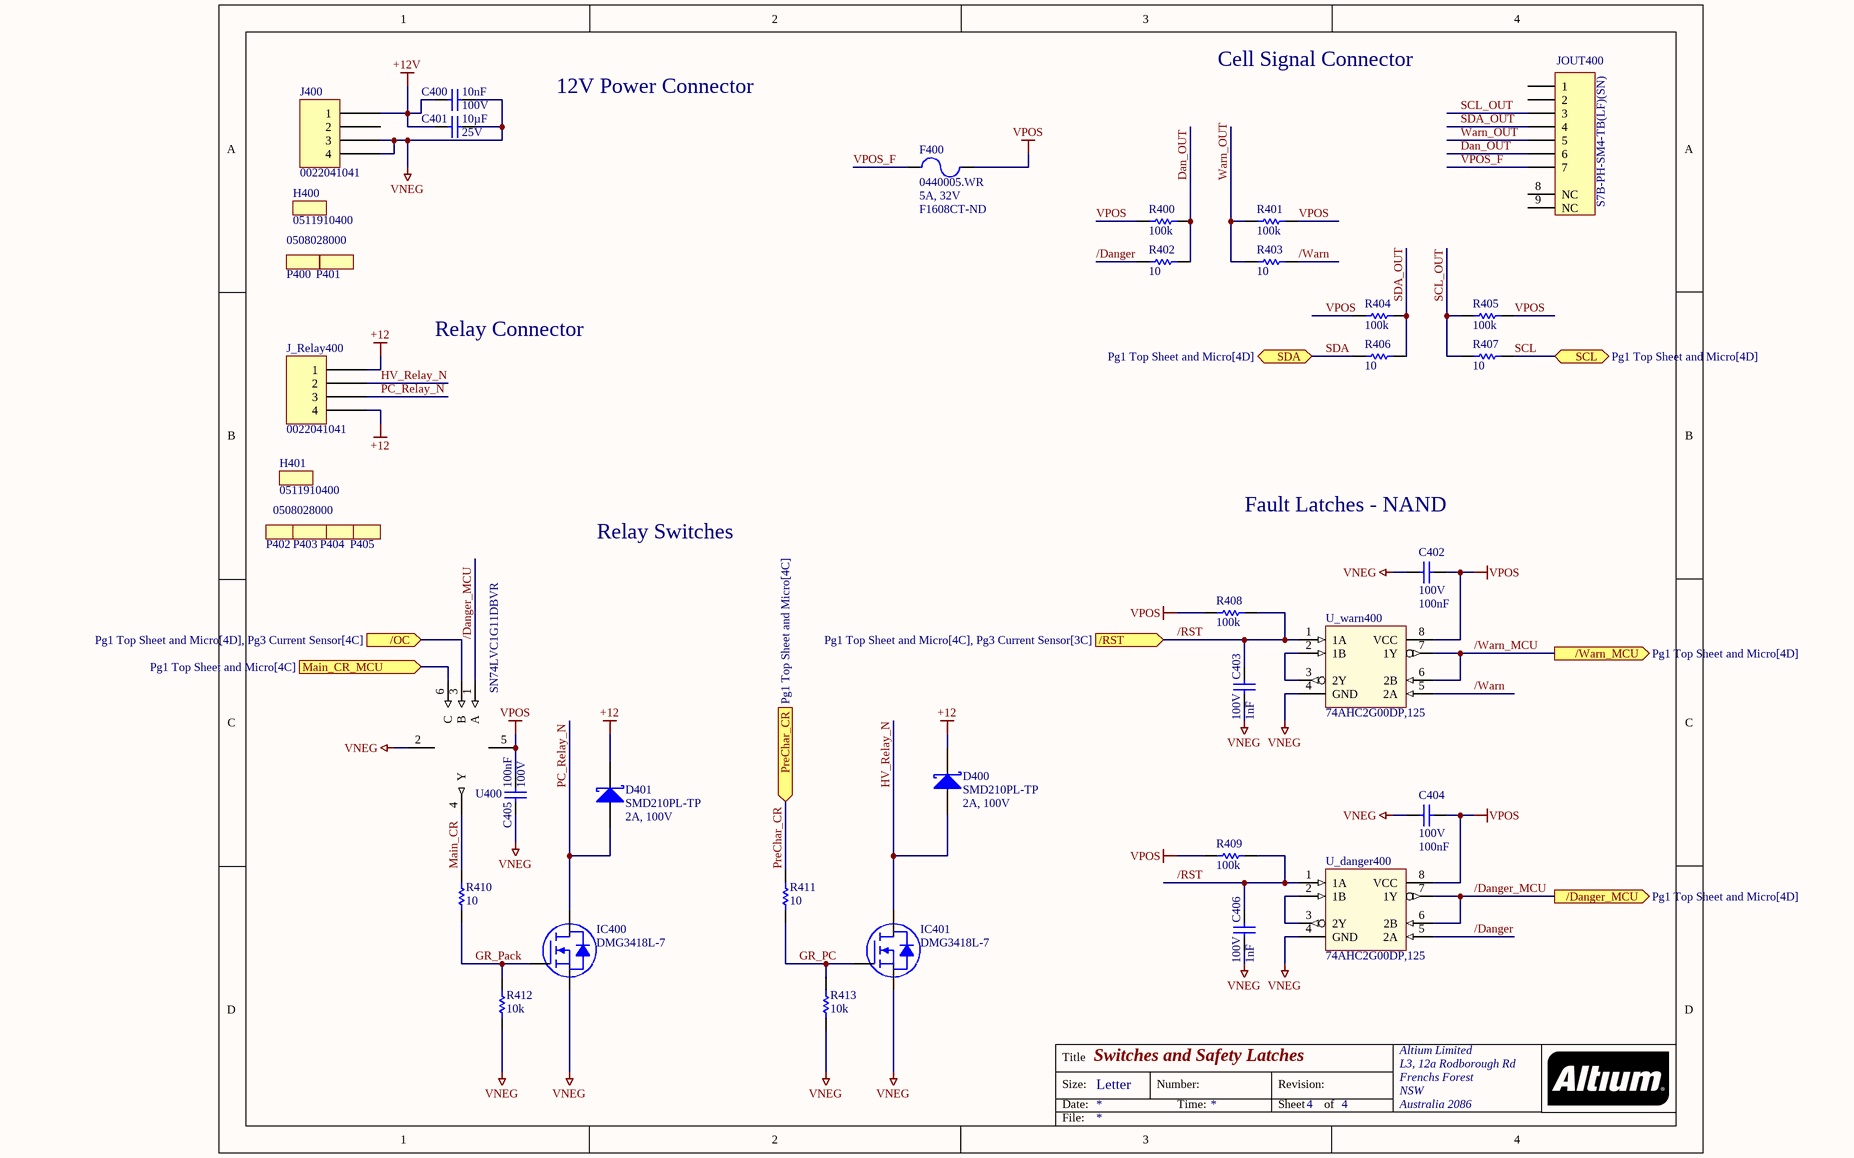
[diagram p2: Pg4 Switches, Latches, Connectors.SchDoc]

### Parts
C400  value 10nF  Rated: 100V  [CAPC2012N]  (hidden comment: C0805C103K1RAC7025)
C401  value 10µF  Rated: 25V  [CAPC3225N]  (hidden comment: C1210C106K3RACAUTO)
C402  value 100nF  Rated: 100V  [CAPC2012N]  (hidden comment: CL21B104KACNNNC)
C403  value 1nF  Rated: 100V  [CAPC2012N]  (hidden comment: C0805C102K1RACAUTO)
C404  value 100nF  Rated: 100V  [CAPC2012N]  (hidden comment: CL21B104KACNNNC)
C405  value 100nF  Rated: 100V  [CAPC2012N]  (hidden comment: CL21B104KACNNNC)
C406  value 1nF  Rated: 100V  [CAPC2012N]  (hidden comment: C0805C102K1RACAUTO)
D400  SMD210PL-TP  Rated: 2A, 100V  [SOD123]
D401  SMD210PL-TP  Rated: 2A, 100V  [SOD123]
F400  0440005.WR  Rated: 5A, 32V  Supplier Part Number 1: F1608CT-ND  [CAPC1608N]
H400  0511910400  (mechanical)
H401  0511910400  (mechanical)
IC400  DMG3418L-7  [DIODES SOT-23-3]
IC401  DMG3418L-7  [DIODES SOT-23-3]
J400  0022041041  [0022041041]
J_Relay400  0022041041  [0022041041]
JOUT400  S7B-PH-SM4-TB(LF)(SN)  [JST-PH-S7]
P400  0508028000  (value not drawn)  (mechanical)
P401  0508028000  (mechanical)
P402  0508028000  (value not drawn)  (mechanical)
P403  0508028000  (value not drawn)  (mechanical)
P404  0508028000  (value not drawn)  (mechanical)
P405  0508028000  (mechanical)
R400  value 100k  [RESC2012N]  (hidden comment: ERJ-6ENF1003V)
R401  value 100k  [RESC2012N]  (hidden comment: ERJ-6ENF1003V)
R402  value 10  [RESC2012N]  (hidden comment: ERJ-6ENF10R0V)
R403  value 10  [RESC2012N]  (hidden comment: ERJ-6ENF10R0V)
R404  value 100k  [RESC2012N]  (hidden comment: ERJ-6ENF1003V)
R405  value 100k  [RESC2012N]  (hidden comment: ERJ-6ENF1003V)
R406  value 10  [RESC2012N]  (hidden comment: ERJ-6ENF10R0V)
R407  value 10  [RESC2012N]  (hidden comment: ERJ-6ENF10R0V)
R408  value 100k  [RESC2012N]  (hidden comment: ERJ-6ENF1003V)
R409  value 100k  [RESC2012N]  (hidden comment: ERJ-6ENF1003V)
R410  value 10  [RESC2012N]  (hidden comment: ERJ-6ENF10R0V)
R411  value 10  [RESC2012N]  (hidden comment: ERJ-6ENF10R0V)
R412  value 10k  [RESC2012N]  (hidden comment: ERJ-6ENF1002V)
R413  value 10k  [RESC2012N]  (hidden comment: ERJ-6ENF1002V)
U400  SN74LVC1G11DBVR  [SOT23-6N]
U_danger400  74AHC2G00DP,125  [TSSOP-8]
U_warn400  74AHC2G00DP,125  [TSSOP-8]

### Ports
/Danger_MCU (out, see Pg1 Top Sheet and Micro[4D]), /OC (in, see Pg1 Top Sheet and Micro[4D], Pg3 Current Sensor[4C]), /RST (in, see Pg1 Top Sheet and Micro[4C], Pg3 Current Sensor[3C]), /Warn_MCU (out, see Pg1 Top Sheet and Micro[4D]), Main_CR_MCU (in, see Pg1 Top Sheet and Micro[4C]), PreChar_CR (in, see Pg1 Top Sheet and Micro[4C]), SCL (bidir, see Pg1 Top Sheet and Micro[4D]), SDA (bidir, see Pg1 Top Sheet and Micro[4D])

### Nets
+12: D400.2(K) D401.2(K) J_Relay400.1 J_Relay400.4
+12V: C400.1 C401.1 J400.1
VNEG: C400.2 C401.2 C402.2 C403.2 C404.2 C405.2 C406.2 IC400.2(S) IC401.2(S) J400.3 J400.4 R412.1 R413.1 U400.2(GND) U_danger400.4(GND) U_warn400.4(GND)
VPOS: C402.1 C404.1 C405.1 F400.2 R400.2 R401.1 R404.2 R405.1 R408.2 R409.2 U400.5(VCC) U_danger400.8(VCC) U_warn400.8(VCC)
/Danger: R402.1 U_danger400.5(2A)
/Danger_MCU: U400.1(A) U_danger400.6(2B) U_danger400.7(1Y) ; port /Danger_MCU
/OC: U400.3(B) ; port /OC
/RST: C403.1 C406.1 R408.1 R409.1 U_danger400.1(1A) U_warn400.1(1A) ; port /RST
/Warn: R403.2 U_warn400.5(2A)
/Warn_MCU: U_warn400.6(2B) U_warn400.7(1Y) ; port /Warn_MCU
Dan_OUT: JOUT400.6 R400.1 R402.2
GR_Pack: IC400.1(G) R410.1 R412.2
GR_PC: IC401.1(G) R411.1 R413.2
HV_Relay_N: D400.1(A) IC401.3(D) J_Relay400.2
Main_CR: R410.2 U400.4(Y)
MAIN_CR_MCU: U400.6(C) ; port Main_CR_MCU
PC_Relay_N: D401.1(A) IC400.3(D) J_Relay400.3
PreChar_CR: R411.2 ; port PreChar_CR
SCL: R407.2 ; port SCL
SCL_OUT: JOUT400.3 R405.2 R407.1
SDA: R406.1 ; port SDA
SDA_OUT: JOUT400.4 R404.1 R406.2
VPOS_F: F400.1 JOUT400.7
Warn_OUT: JOUT400.5 R401.2 R403.1
NetU_danger400_2: U_danger400.2(1B) U_danger400.3(2Y)
NetU_warn400_2: U_warn400.2(1B) U_warn400.3(2Y)

Not connected (* = marked no-connect by the designer): J400 2; JOUT400 1 2 8(NC) 9(NC)

### Notes on the sheet
- 12V Power Connector
- Cell Signal Connector
- Relay Connector
- Relay Switches
- Fault Latches - NAND
- Title
- Size:
- Date:
- Letter
- Number:
- Time:
- Revision:
- Sheet
- of
- File:

### Library data of the parts
C400 = C0805C103K1RAC7025: as C110 on sheet Pg1 Top Sheet and Micro; Supplier 1: Digi-Key; Supplier Part Number 1: 399-C0805C103K1RAC7025CT-ND; Category: C; Tol: 10%; Temp: 125C
C401 = C1210C106K3RACAUTO: as C106 on sheet Pg1 Top Sheet and Micro; Supplier 1: Digi-Key; Supplier Part Number 1: 399-7046-1-ND; Category: C; Tol: 10%; Temp: 125C
C402 C404 C405 = C0805C104K1RACAUTO: as C305 on sheet Pg3 Current Sensor; Category: C; Tol: 10%; Temp: 125C; Supplier 1: Digi-Key; Supplier Part Number 1: 1276-1099-1-ND
C403 C406 = C0805C102K1RACAUTO: as C314 on sheet Pg3 Current Sensor; Supplier 1: Digi-Key; Supplier Part Number 1: 399-6919-1-ND; Category: C; Tol: 10%; Temp: 125C
D400 D401 = SMD210PL: Diode, Si Sch, 100V, 2A, SOD123; Temp: 125C; Value: 850mV @ 2A; Category: D; Supplier 1: Digi-Key; Supplier Part Number 1: SMD210PL-TPMSCT-ND
F400 = 0440005.WR: Fuse, SMT, 5A, 32VAC/VDC, 1206; Value: 12mOhm; Temp: 150C; Category: F; Supplier 1: Digi-Key
H400 H401 = 0022041041(Housing): as H300 on sheet Pg3 Current Sensor; Category: J; Supplier 1: Digi-Key; Supplier Part Number 1: WM3350-ND
IC400 IC401 = DMG3418L-7: MOSFET N-CH 30V 4A SOT23; Manufacturer: Diodes Incorporated; Current - Continuous Drain (Id) @ 25°C: 4A (Ta); Drive Voltage (Max Rds On,  Min Rds On): 2.5V, 10V; FET Type: N-Channel; Gate Charge (Qg) (Max) @ Vgs: 5.5 nC @ 4.5 V; Input Capacitance (Ciss) (Max) @ Vds: 464.3 pF @ 15 V; Power Dissipation (Max): 1.4W (Ta); Rds On (Max) @ Id, Vgs: 60mOhm @ 4A, 10V; Vgs (Max): ±12V; Vgs(th) (Max) @ Id: 1.5V @ 250µA; Part Number: DMG3418L-7; ComponentLink1Description: Datasheet; ComponentLink1URL: https://www.diodes.com/assets/Datasheets/DMG3418L.pdf; ComponentLink2Description: DigiKey Link; ComponentLink2URL: https://www.digikey.com/en/products/detail/diodes-incorporated/DMG3418L-7/4810932; Drain to Source Voltage (Vdss): 30 V; LastUpdated: 2/2/2023 9:00:08 PM; Lifecycle Status: Active; Minimum Order: 1; Mounting Type: Surface Mount; Operating Temperature: -55°C ~ 150°C (TJ); Package / Case: TO-236-3, SC-59, SOT-23-3; Packaging: TapeAndReel; Part Status: Active; Price: 0.10; Series: -; Supplier 1: DigiKey; Supplier Part Number 1: DMG3418L-7DICT-ND; Supplier Device Package: SOT-23-3; Technology: MOSFET (Metal Oxide)
J400 J_Relay400 = 0022041041: as J_LEM300 on sheet Pg3 Current Sensor; Rated: N/A; Category: J; Tol: N/A; Supplier 1: Digi-Key; Supplier Part Number 1: WM18787-ND
JOUT400 = S7B-PH-SM4-TB(LF)(SN): Header, JST, 7-Pin, Right-Angle, PH, Surface Mount; Category: J; Supplier 1: Digi-Key; Supplier Part Number 1: 455-1754-1-ND
P400-P405 = 0022041041(Terminal): as P300 on sheet Pg3 Current Sensor; Category: J; Supplier 1: Digi-Key; Supplier Part Number 1: WM3328CT-ND
R400 R401 R404 R405 R408 R409 = ERJ-6ENF1003V: as R310 on sheet Pg3 Current Sensor; Supplier 1: Digi-Key; Supplier Part Number 1: P100KCCT-ND; Rated: 1/8W; Tol: 1%; Category: R
R402 R403 R406 R407 R410 R411 = ERJ-6ENF10R0V: Resistor, Fixed, 10 Ohm, 0805, 1%, 1/8W; Supplier 1: Digi-Key; Supplier Part Number 1: P10.0CCT-ND; Rated: 1/8W; Tol: 1%; Category: R
R412 R413 = ERJ-6ENF1002V: Resistor, Fixed, 10 kOhm, 0805, 1%, 1/8W; Supplier 1: Digi-Key; Supplier Part Number 1: P10.0KCCT-ND; Rated: 1/8W; Tol: 1%; Category: R
U400 = 74LVC1G11: Logic, AND, Single, 3-In, SOT23-6; Rated: 1.65 ~ 5.5V; Category: U; Supplier 1: Digi-Key; Supplier Part Number 1: 296-16810-1-ND
U_danger400 U_warn400 = 74AHC2G00: as U302 on sheet Pg3 Current Sensor; Category: U; Supplier 1: Digi-Key; Supplier Part Number 1: 1727-6521-1-ND

## Sheet Pg2 B Terminals & Balancing.SchDoc: EV Kartz Main BMS
size Letter; Organization: Kettering University; Address1: EV Kartz; Address2: Battery Project; Address3: Flint, MI; Address4: United States of America; DocumentNumber: 1; Revision: 1; SheetNumber: 3; SheetTotal: 4
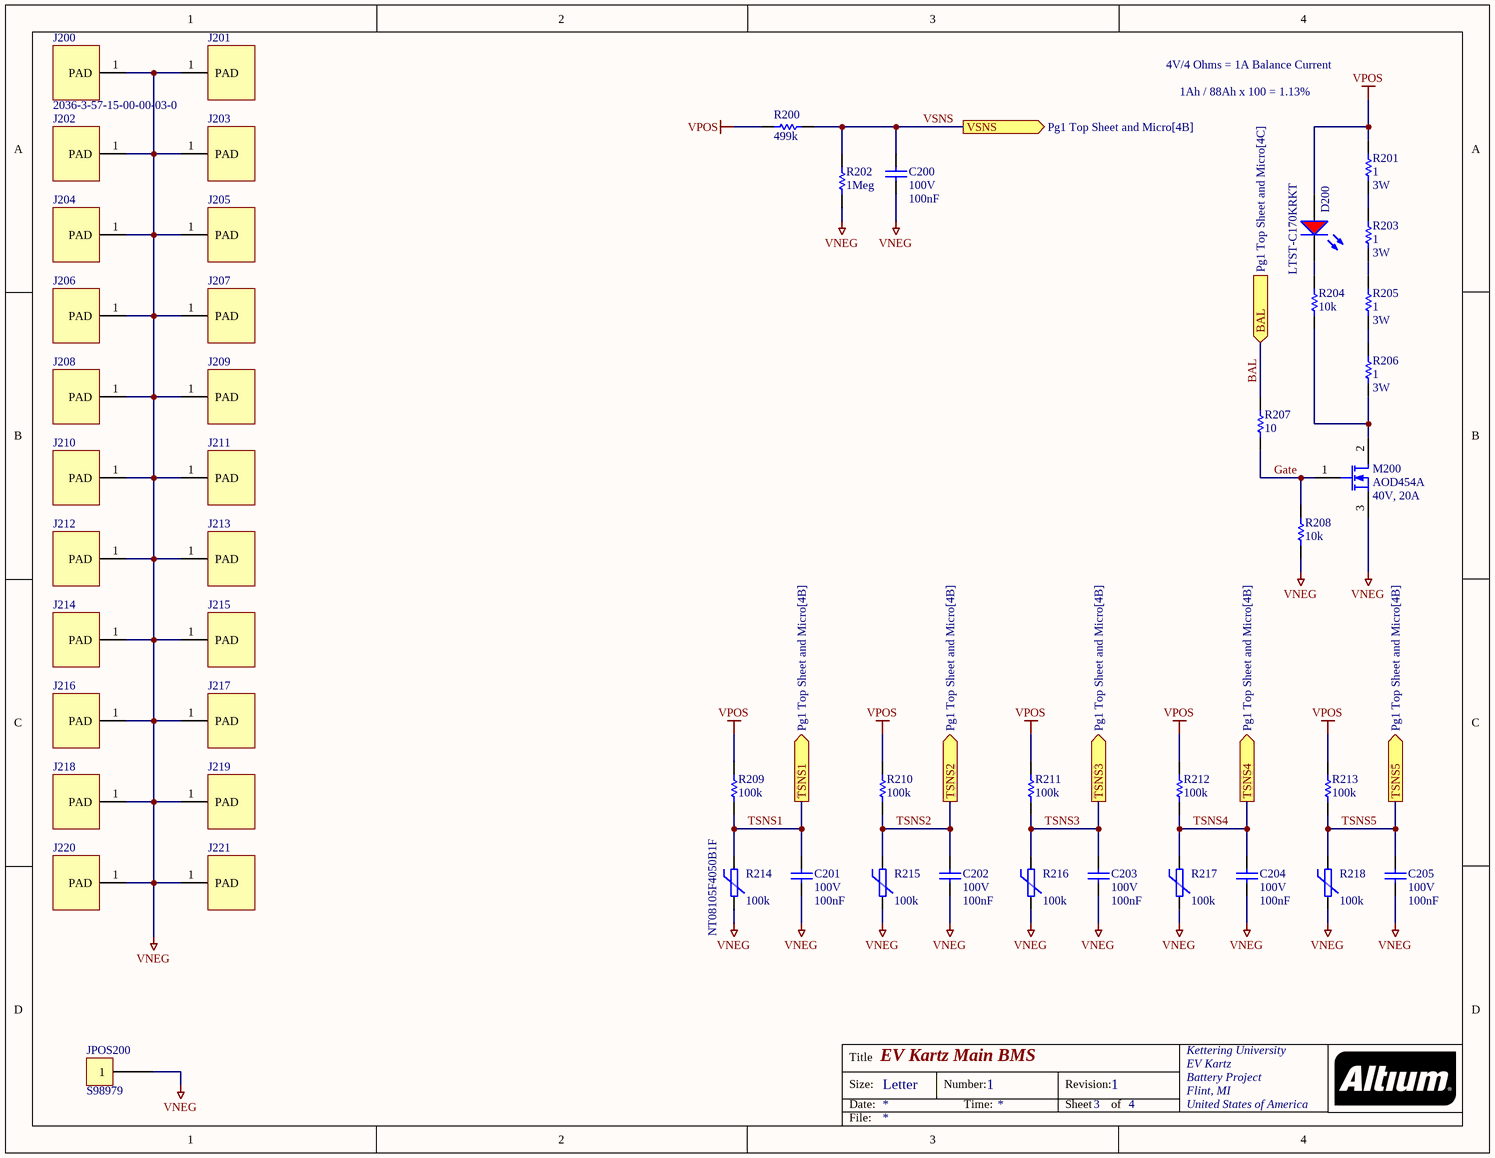
[diagram p3: Pg2 B Terminals & Balancing.SchDoc]

### Parts
C200  value 100nF  Rated: 100V  [CAPC2012N]  (hidden comment: C0805C104K1RACAUTO)
C201  value 100nF  Rated: 100V  [CAPC2012N]  (hidden comment: C0805C104K1RACAUTO)
C202  value 100nF  Rated: 100V  [CAPC2012N]  (hidden comment: C0805C104K1RACAUTO)
C203  value 100nF  Rated: 100V  [CAPC2012N]  (hidden comment: C0805C104K1RACAUTO)
C204  value 100nF  Rated: 100V  [CAPC2012N]  (hidden comment: C0805C104K1RACAUTO)
C205  value 100nF  Rated: 100V  [CAPC2012N]  (hidden comment: C0805C104K1RACAUTO)
D200  LTST-C170KRKT  [DIO2012N-R]
J200  2036-3-57-15-00-00-03-0  [6mm Pad]
J201  2036-3-57-15-00-00-03-0  [6mm Pad]  (value not drawn)
J202  2036-3-57-15-00-00-03-0  [6mm Pad]  (value not drawn)
J203  2036-3-57-15-00-00-03-0  [6mm Pad]  (value not drawn)
J204  2036-3-57-15-00-00-03-0  [6mm Pad]  (value not drawn)
J205  2036-3-57-15-00-00-03-0  [6mm Pad]  (value not drawn)
J206  2036-3-57-15-00-00-03-0  [6mm Pad]  (value not drawn)
J207  2036-3-57-15-00-00-03-0  [6mm Pad]  (value not drawn)
J208  2036-3-57-15-00-00-03-0  [6mm Pad]  (value not drawn)
J209  2036-3-57-15-00-00-03-0  [6mm Pad]  (value not drawn)
J210  2036-3-57-15-00-00-03-0  [6mm Pad]  (value not drawn)
J211  2036-3-57-15-00-00-03-0  [6mm Pad]  (value not drawn)
J212  2036-3-57-15-00-00-03-0  [6mm Pad]  (value not drawn)
J213  2036-3-57-15-00-00-03-0  [6mm Pad]  (value not drawn)
J214  2036-3-57-15-00-00-03-0  [6mm Pad]  (value not drawn)
J215  2036-3-57-15-00-00-03-0  [6mm Pad]  (value not drawn)
J216  2036-3-57-15-00-00-03-0  [6mm Pad]  (value not drawn)
J217  2036-3-57-15-00-00-03-0  [6mm Pad]  (value not drawn)
J218  2036-3-57-15-00-00-03-0  [6mm Pad]  (value not drawn)
J219  2036-3-57-15-00-00-03-0  [6mm Pad]  (value not drawn)
J220  2036-3-57-15-00-00-03-0  [6mm Pad]  (value not drawn)
J221  2036-3-57-15-00-00-03-0  [6mm Pad]  (value not drawn)
JPOS200  S98979  [S98979]
M200  AOD454A  Rated: 40V, 20A  [TO252-3N]
R200  value 499k  [RESC2012N]  (hidden comment: ERJ-6ENF4993V)
R201  value 1  Rated: 3W  [RESC6432N]  (hidden comment: 35221R0JT)
R202  value 1Meg  [RESC2012N]  (hidden comment: ERJ-6ENF1004V)
R203  value 1  Rated: 3W  [RESC6432N]  (hidden comment: 35221R0JT)
R204  value 10k  [RESC2012N]  (hidden comment: ERJ-6ENF1002V)
R205  value 1  Rated: 3W  [RESC6432N]  (hidden comment: 35221R0JT)
R206  value 1  Rated: 3W  [RESC6432N]  (hidden comment: 35221R0JT)
R207  value 10  [RESC2012N]  (hidden comment: ERJ-6ENF10R0V)
R208  value 10k  [RESC2012N]  (hidden comment: ERJ-6ENF1002V)
R209  value 100k  [RESC2012N]  (hidden comment: ERJ-6ENF1003V)
R210  value 100k  [RESC2012N]  (hidden comment: ERJ-6ENF1003V)
R211  value 100k  [RESC2012N]  (hidden comment: ERJ-6ENF1003V)
R212  value 100k  [RESC2012N]  (hidden comment: ERJ-6ENF1003V)
R213  value 100k  [RESC2012N]  (hidden comment: ERJ-6ENF1003V)
R214  NT08105F4050B1F  value 100k  [RESC2012N]
R215  value 100k  [RESC2012N]  (hidden comment: NT08105F4050B1F)
R216  value 100k  [RESC2012N]  (hidden comment: NT08105F4050B1F)
R217  value 100k  [RESC2012N]  (hidden comment: NT08105F4050B1F)
R218  value 100k  [RESC2012N]  (hidden comment: NT08105F4050B1F)

### Ports
BAL (in, see Pg1 Top Sheet and Micro[4C]), TSNS1 (out, see Pg1 Top Sheet and Micro[4B]), TSNS2 (out, see Pg1 Top Sheet and Micro[4B]), TSNS3 (out, see Pg1 Top Sheet and Micro[4B]), TSNS4 (out, see Pg1 Top Sheet and Micro[4B]), TSNS5 (out, see Pg1 Top Sheet and Micro[4B]), VSNS (out, see Pg1 Top Sheet and Micro[4B])

### Nets
VNEG: C200.2 C201.2 C202.2 C203.2 C204.2 C205.2 J200.1(PAD) J201.1(PAD) J202.1(PAD) J203.1(PAD) J204.1(PAD) J205.1(PAD) J206.1(PAD) J207.1(PAD) J208.1(PAD) J209.1(PAD) J210.1(PAD) J211.1(PAD) J212.1(PAD) J213.1(PAD) J214.1(PAD) J215.1(PAD) J216.1(PAD) J217.1(PAD) J218.1(PAD) J219.1(PAD) J220.1(PAD) J221.1(PAD) JPOS200.1 M200.3(S) R202.1 R208.1 R214.2 R215.2 R216.2 R217.2 R218.2
VPOS: D200.1(A) R200.2 R201.2 R209.2 R210.2 R211.2 R212.2 R213.2
BAL: R207.2 ; port BAL
Gate: M200.1(G) R207.1 R208.2
TSNS1: C201.1 R209.1 R214.1 ; port TSNS1
TSNS2: C202.1 R210.1 R215.1 ; port TSNS2
TSNS3: C203.1 R211.1 R216.1 ; port TSNS3
TSNS4: C204.1 R212.1 R217.1 ; port TSNS4
TSNS5: C205.1 R213.1 R218.1 ; port TSNS5
VSNS: C200.1 R200.1 R202.2 ; port VSNS
NetD200_2: D200.2(K) R204.2
NetM200_2: M200.2(D) R204.1 R206.1
NetR201_1: R201.1 R203.2
NetR203_1: R203.1 R205.2
NetR205_1: R205.1 R206.2

### Notes on the sheet
- 4V/4 Ohms = 1A Balance Current
- 1Ah / 88Ah x 100 = 1.13%
- Title
- Size:
- Date:
- Letter
- Number:
- Time:
- Revision:
- Sheet
- of
- File:

### Library data of the parts
C200-C205 = C0805C104K1RACAUTO: as C102 on sheet Pg1 Top Sheet and Micro; Supplier 1: Digi-Key; Supplier Part Number 1: 399-6926-1-ND; Category: C; Tol: 10%; Temp: 125C
D200 = LTST-C170KRKT: LED, SMT 0805, Red, 2.0V, 20mA; Rated: 2.0V, 20mA, 54mcd; Supplier 1: Digi-Key; Supplier Part Number 1: 160-1415-1-ND; Category: D; Value: RED
J200-J221 = 2036-3-57-15-00-00-03-0: Hardware, Sprint Contact Surface; Supplier 1: Digi-Key; Supplier Part Number 1: 54-2036-3-57-15-00-00-03-0CT-ND
JPOS200 = S98979: Screw Terminal M8, 360A
M200 = AOD454A: MOSFET, N-Ch, 40V, 20A, 430mOhm, TO252; Value: 30mOhm @ 10V; Vgs(th): 3.0V; Category: M; Supplier 1: Digi-Key; Supplier Part Number 1: 785-1223-1-ND
R200 = ERJ-6ENF4993V: Resistor, Fixed, 499 kOhm, 0805, 1%, 1/8W; Supplier 1: Digi-Key; Supplier Part Number 1: P499KCCT-ND; Rated: 1/8W; Tol: 1%; Category: R
R201 R203 R205 R206 = 35221R0JT: Resistor, Power, 1 Ohm, 6432, 5%, 3W; Tol: 5%; Category: R; Supplier 1: Digi-Key; Supplier Part Number 1: A121177CT-ND
R202 = ERJ-6ENF1004V: Resistor, Fixed, 1 MOhm, 0805, 1%, 1/8W; Supplier 1: Digi-Key; Supplier Part Number 1: P1.00MCCT-ND; Rated: 1/8W; Tol: 1%; Category: R
R204 R208 = ERJ-6ENF1002V: Resistor, Fixed, 10 kOhm, 0805, 1%, 1/8W; Supplier 1: Digi-Key; Supplier Part Number 1: P10.0KCCT-ND; Rated: 1/8W; Tol: 1%; Category: R
R207 = ERJ-6ENF10R0V: Resistor, Fixed, 10 Ohm, 0805, 1%, 1/8W; Supplier 1: Digi-Key; Supplier Part Number 1: P10.0CCT-ND; Rated: 1/8W; Tol: 1%; Category: R
R209-R213 = ERJ-6ENF1003V: as R310 on sheet Pg3 Current Sensor; Supplier 1: Digi-Key; Supplier Part Number 1: P100KCCT-ND; Rated: 1/8W; Tol: 1%; Category: R
R214-R218 = NTCS0805E3103FMT: Resistor, NTC Thermistor, 100kOhm, 0805, 1%, 125C; Temp: 150C; Rated: 3570K; Tol: 1%; Category: R; Supplier 1: DigiKey; Supplier Part Number 1: 283-NT08105F4050B1FCT-ND

## Nets that join several sheets
+12V: Pg3 Current Sensor (6 pins), Pg4 Switches, Latches, Connectors (C400.1 C401.1 J400.1)
VNEG: Pg1 Top Sheet and Micro (15 pins), Pg3 Current Sensor (28 pins), Pg4 Switches, Latches, Connectors (16 pins), Pg2 B Terminals & Balancing (37 pins)
VPOS: Pg1 Top Sheet and Micro (6 pins), Pg3 Current Sensor (8 pins), Pg4 Switches, Latches, Connectors (13 pins), Pg2 B Terminals & Balancing (8 pins)
/Danger_MCU: Pg1 Top Sheet and Micro (U102.1), Pg4 Switches, Latches, Connectors (U400.1 U_danger400.6 U_danger400.7)
/OC: Pg1 Top Sheet and Micro (U102.16), Pg3 Current Sensor (U302.6 U302.7), Pg4 Switches, Latches, Connectors (U400.3)
/RST: Pg1 Top Sheet and Micro (U102.15), Pg3 Current Sensor (C314.1 R310.1 U302.1), Pg4 Switches, Latches, Connectors (6 pins)
/Warn_MCU: Pg1 Top Sheet and Micro (U102.2), Pg4 Switches, Latches, Connectors (U_warn400.6 U_warn400.7)
BAL: Pg1 Top Sheet and Micro (U102.17), Pg2 B Terminals & Balancing (R207.2)
ISNS: Pg1 Top Sheet and Micro (U102.12), Pg3 Current Sensor (R309.1 R311.1 U304.4)
MAIN_CR_MCU: Pg1 Top Sheet and Micro (R102.2), Pg4 Switches, Latches, Connectors (U400.6)
PreChar_CR: Pg1 Top Sheet and Micro (R103.2), Pg4 Switches, Latches, Connectors (R411.2)
SCL: Pg1 Top Sheet and Micro (U102.22), Pg4 Switches, Latches, Connectors (R407.2)
SDA: Pg1 Top Sheet and Micro (U102.21), Pg4 Switches, Latches, Connectors (R406.1)
TSNS1: Pg1 Top Sheet and Micro (U102.3), Pg2 B Terminals & Balancing (C201.1 R209.1 R214.1)
TSNS2: Pg1 Top Sheet and Micro (U102.4), Pg2 B Terminals & Balancing (C202.1 R210.1 R215.1)
TSNS3: Pg1 Top Sheet and Micro (U102.5), Pg2 B Terminals & Balancing (C203.1 R211.1 R216.1)
TSNS4: Pg1 Top Sheet and Micro (U102.6), Pg2 B Terminals & Balancing (C204.1 R212.1 R217.1)
TSNS5: Pg1 Top Sheet and Micro (U102.7), Pg2 B Terminals & Balancing (C205.1 R213.1 R218.1)
VSNS: Pg1 Top Sheet and Micro (U102.8), Pg2 B Terminals & Balancing (C200.1 R200.1 R202.2)